# EAGLE design knitic sol connect kh970 (EAGLE 7.2.0)
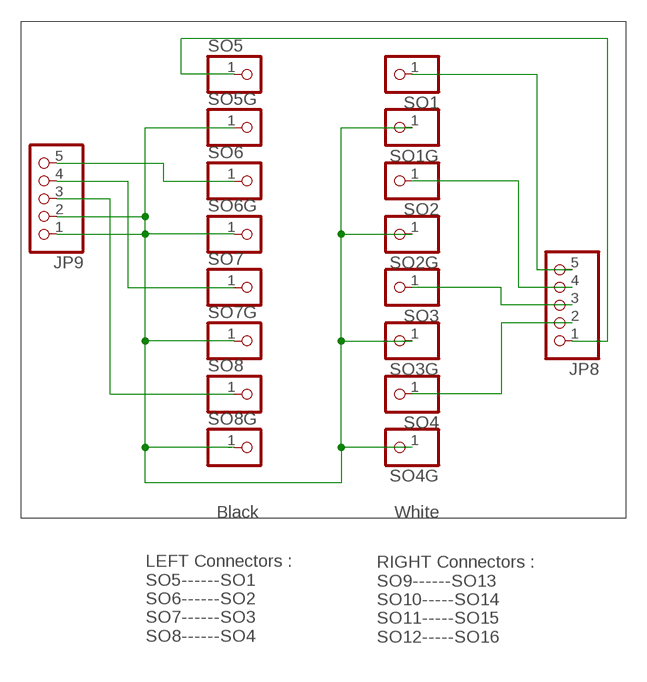
[diagram p0: schematic, sheet 1]

## Parts
JP8  PINHD-1X5  [1X05]
JP9  PINHD-1X5  [1X05]
SO1  PINHD-1X1  [1X01]
SO1G  PINHD-1X1  [1X01]
SO2  PINHD-1X1  [1X01]
SO2G  PINHD-1X1  [1X01]
SO3  PINHD-1X1  [1X01]
SO3G  PINHD-1X1  [1X01]
SO4  PINHD-1X1  [1X01]
SO4G  PINHD-1X1  [1X01]
SO5  PINHD-1X1  [1X01]
SO5G  PINHD-1X1  [1X01]
SO6  PINHD-1X1  [1X01]
SO6G  PINHD-1X1  [1X01]
SO7  PINHD-1X1  [1X01]
SO7G  PINHD-1X1  [1X01]
SO8  PINHD-1X1  [1X01]
SO8G  PINHD-1X1  [1X01]

## Nets
N$2: JP9.3 SO8.1
N$3: JP9.4 SO7.1
N$5: JP8.1 SO5.1
N$6: JP8.5 SO1.1
N$7: JP8.4 SO2.1
N$8: JP8.3 SO3.1
N$9: JP8.2 SO4.1
N$10: JP9.1 JP9.2 SO1G.1 SO2G.1 SO3G.1 SO4G.1 SO5G.1 SO6G.1 SO7G.1 SO8G.1
SO6G: JP9.5 SO6.1

## Notes on the sheet
- Black | White
- RIGHT Connectors :
  SO9------SO13
  SO10-----SO14
  SO11-----SO15
  SO12-----SO16
- LEFT Connectors :
  SO5------SO1
  SO6------SO2
  SO7------SO3
  SO8------SO4

## Library data of the parts
JP8 JP9 = pinhead:PINHD-1X5: PIN HEADER
SO1 SO1G SO2 SO2G SO3 SO3G SO4 SO4G SO5 SO5G SO6 SO6G SO7 SO7G SO8 SO8G = pinhead:PINHD-1X1: PIN HEADER

## Board
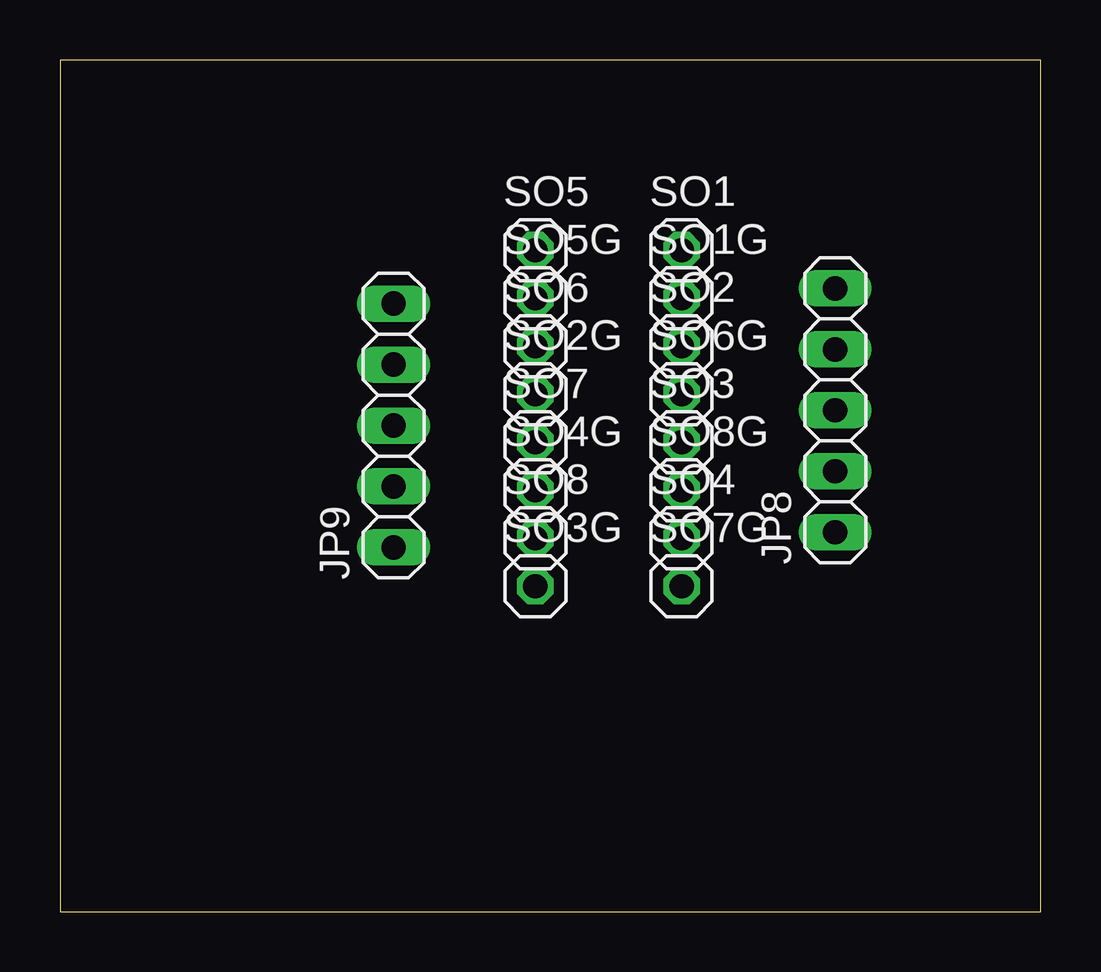
[diagram p1: board, top side]
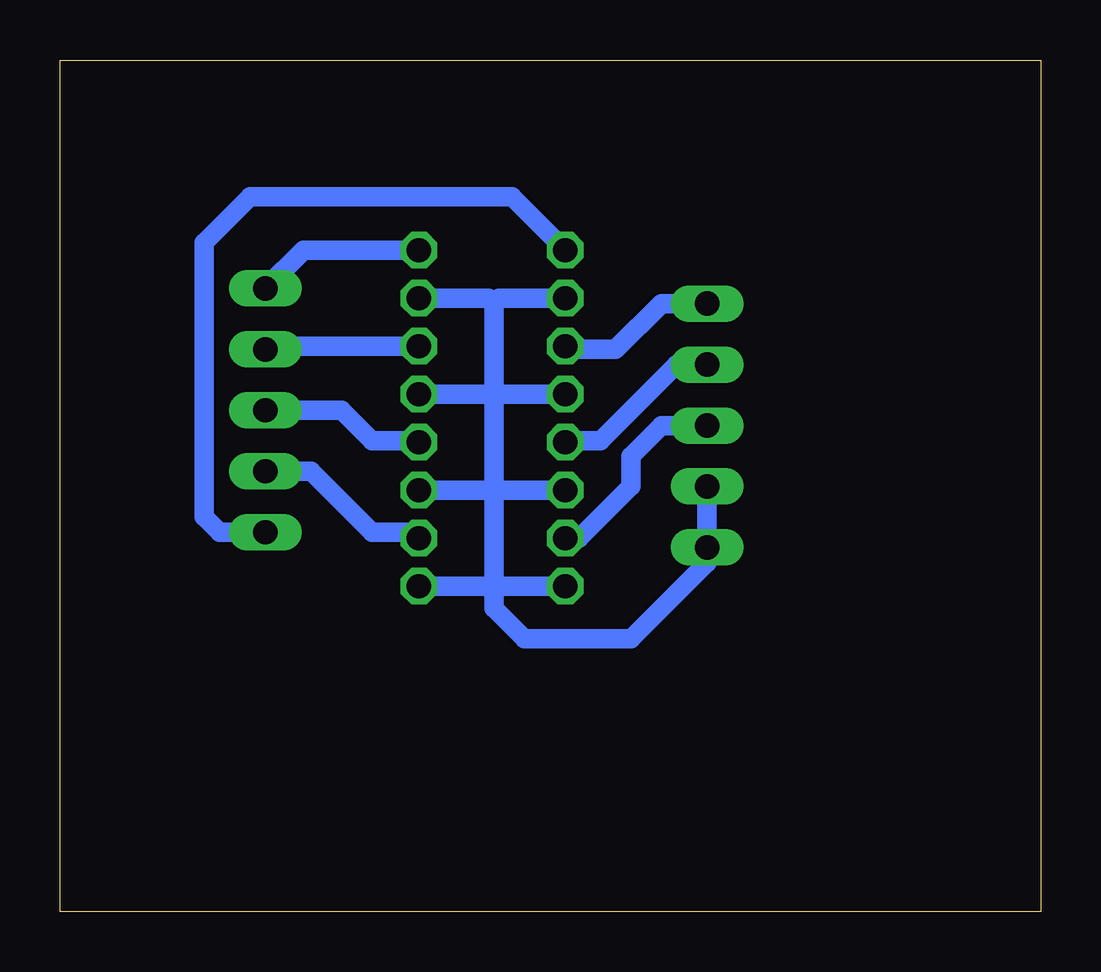
[diagram p2: board, bottom side, seen from below]

Size 40.88 x 35.48 mm. Coordinates in mm from the lower left corner, seen from the top.
Outline: 0,0 40.88,0 40.88,35.48 0,35.48 0,0
Copper layers (1*16): Top 0.035mm / dielectric 1.5mm / Bottom 0.035mm
Design rules "default": minimum track width 10mil, minimum drill 24mil, track to track 8mil, track to pad 8mil, pad to pad 8mil, via to via 8mil, smd to smd 8mil, copper to edge 40mil, drill to drill 8mil, minimum pad ring 10mil, minimum via ring 8mil, stop-mask expansion 4mil, vias tented up to drill 0mil, thermal gap 10mil

### Footprints (pad centres in the part's own frame; a part is rotated, then mirrored left to right if it is on the bottom)
1X05 = drill 1.016 long: 1 -5.08,0; 2 -2.54,0; 3 0,0; 4 2.54,0; 5 5.08,0
1X01 = drill 1.016 octagon: 1 0,0

### Placement (x,y rotation side)
JP8  32.32,20.89 90 top
JP9  13.9,20.26 90 top
SO1  25.91,27.56 0 top
SO1G  25.91,25.56 0 top
SO2  25.91,23.56 0 top
SO2G  19.82,21.56 0 top
SO3  25.91,19.56 0 top
SO3G  19.82,13.56 0 top
SO4  25.91,15.56 0 top
SO4G  19.82,17.56 0 top
SO5  19.82,27.56 0 top
SO5G  19.82,25.56 0 top
SO6  19.82,23.56 0 top
SO6G  25.91,21.56 0 top
SO7  19.82,19.56 0 top
SO7G  25.91,13.56 0 top
SO8  19.82,15.56 0 top
SO8G  25.91,17.56 0 top

### Tracks (layer width: path | path; a pad name or v marks a point on that pad's centre or on a via)
N$2
  Bottom 0.813: SO8.1 19.23,15.56 17.08,17.71 17.08,18.98 15.81,20.26 JP9.3
N$3
  Bottom 0.813: JP9.4 15.18,22.8 18.35,19.62 19.75,19.62 SO7.1
N$5
  Bottom 0.813: SO5.1 22.04,29.78 32.95,29.78 34.86,27.88 34.86,16.45 34.23,15.81 JP8.1
N$6
  Bottom 0.813: SO1.1 30.73,27.56 JP8.5
N$7
  Bottom 0.813: SO2.1 32.19,23.56 JP8.4
N$8
  Bottom 0.813: JP8.3 29.14,20.89 27.88,19.62 25.98,19.62 SO3.1
N$9
  Bottom 0.813: JP8.2 30.41,18.35 27.88,15.81 26.16,15.81 SO4.1
N$10
  Bottom 0.813: SO1G.1 23.02,25.56 22.8,25.34 | 22.8,25.34 22.8,21.52 | 22.8,21.52 22.8,17.71 | 22.8,17.71 22.8,13.27 | 22.8,13.27 22.8,12.63 21.52,11.37 17.08,11.37 13.9,14.54 JP9.1 JP9.2 | SO5G.1 22.57,25.56 22.8,25.34 | SO6G.1 22.83,21.56 22.8,21.52 | SO2G.1 22.76,21.56 22.8,21.52 | SO4G.1 22.64,17.56 22.8,17.71 | SO8G.1 22.95,17.56 22.8,17.71 | SO7G.1 23.09,13.56 22.8,13.27 | SO3G.1 22.51,13.56 22.8,13.27
SO6G
  Bottom 0.813: JP9.5 15.81,25.34 17.71,23.43 19.68,23.43 SO6.1